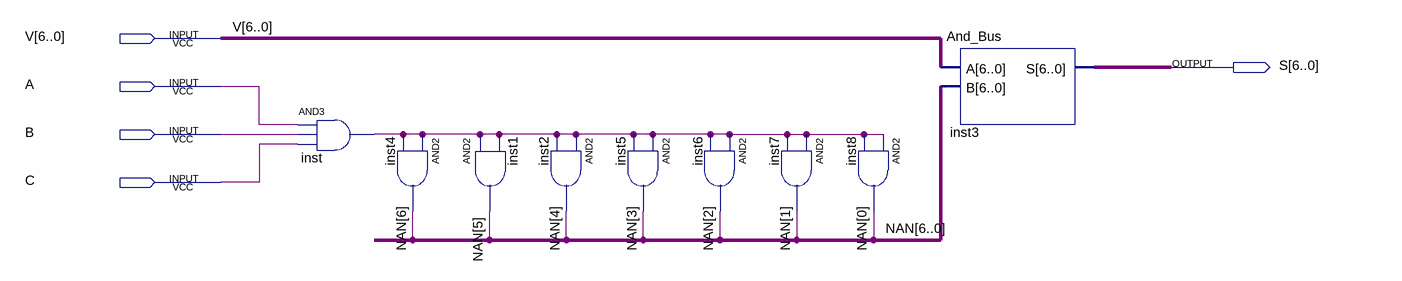
[diagram p0: schematic sheet]
// Quartus schematic And_Mux.bdf as structural Verilog: 9 symbols, 5 pins
module And_Mux (
  input  [6:0] V,
  input  A,
  input  B,
  input  C,
  output [6:0] S
);

  wire inst_out;
  wire [6:0] NAN;

  and inst (inst_out, A, B, C);
  and inst4 (NAN[6], inst_out, inst_out);
  and inst1 (NAN[5], inst_out, inst_out);
  and inst2 (NAN[4], inst_out, inst_out);
  and inst5 (NAN[3], inst_out, inst_out);
  and inst6 (NAN[2], inst_out, inst_out);
  and inst7 (NAN[1], inst_out, inst_out);
  and inst8 (NAN[0], inst_out, inst_out);
  And_Bus inst3 (.A(V), .B(NAN), .S(S));
endmodule
